# Altium project new_motherboard.PrjPCB
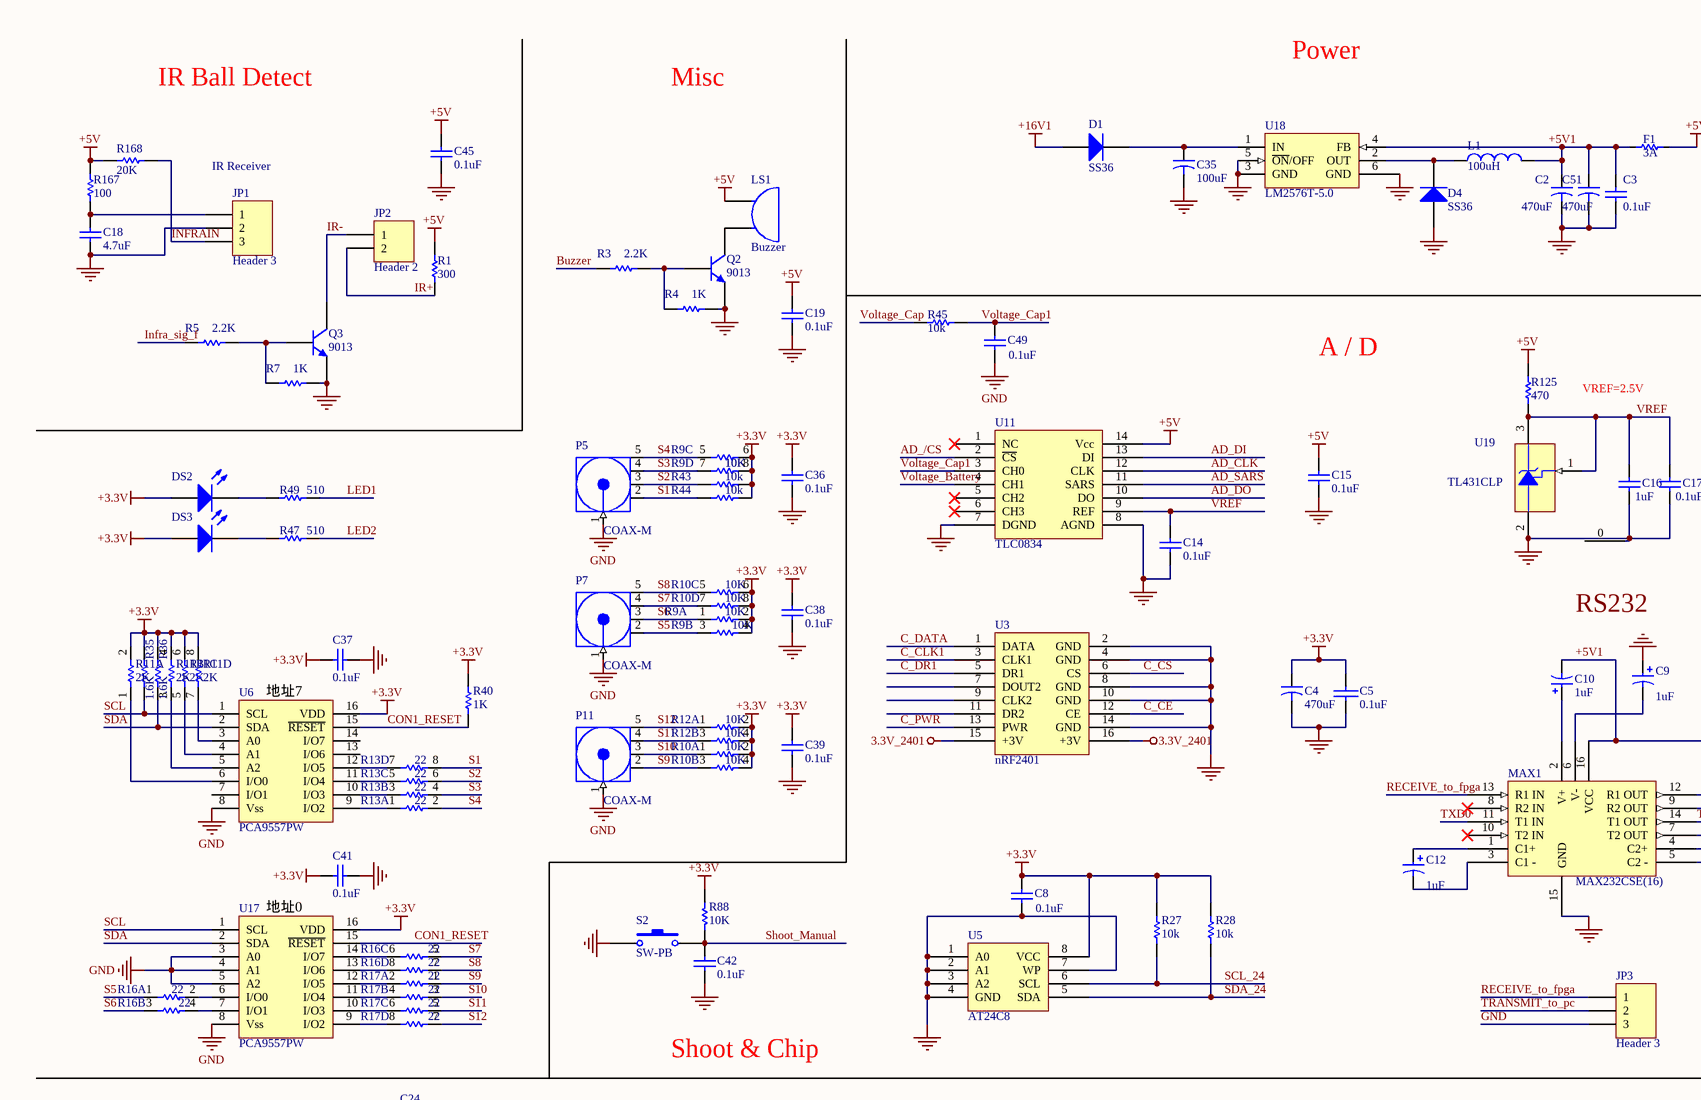
[diagram p0: SS_MB_CONV1.1.SchDoc, top left]
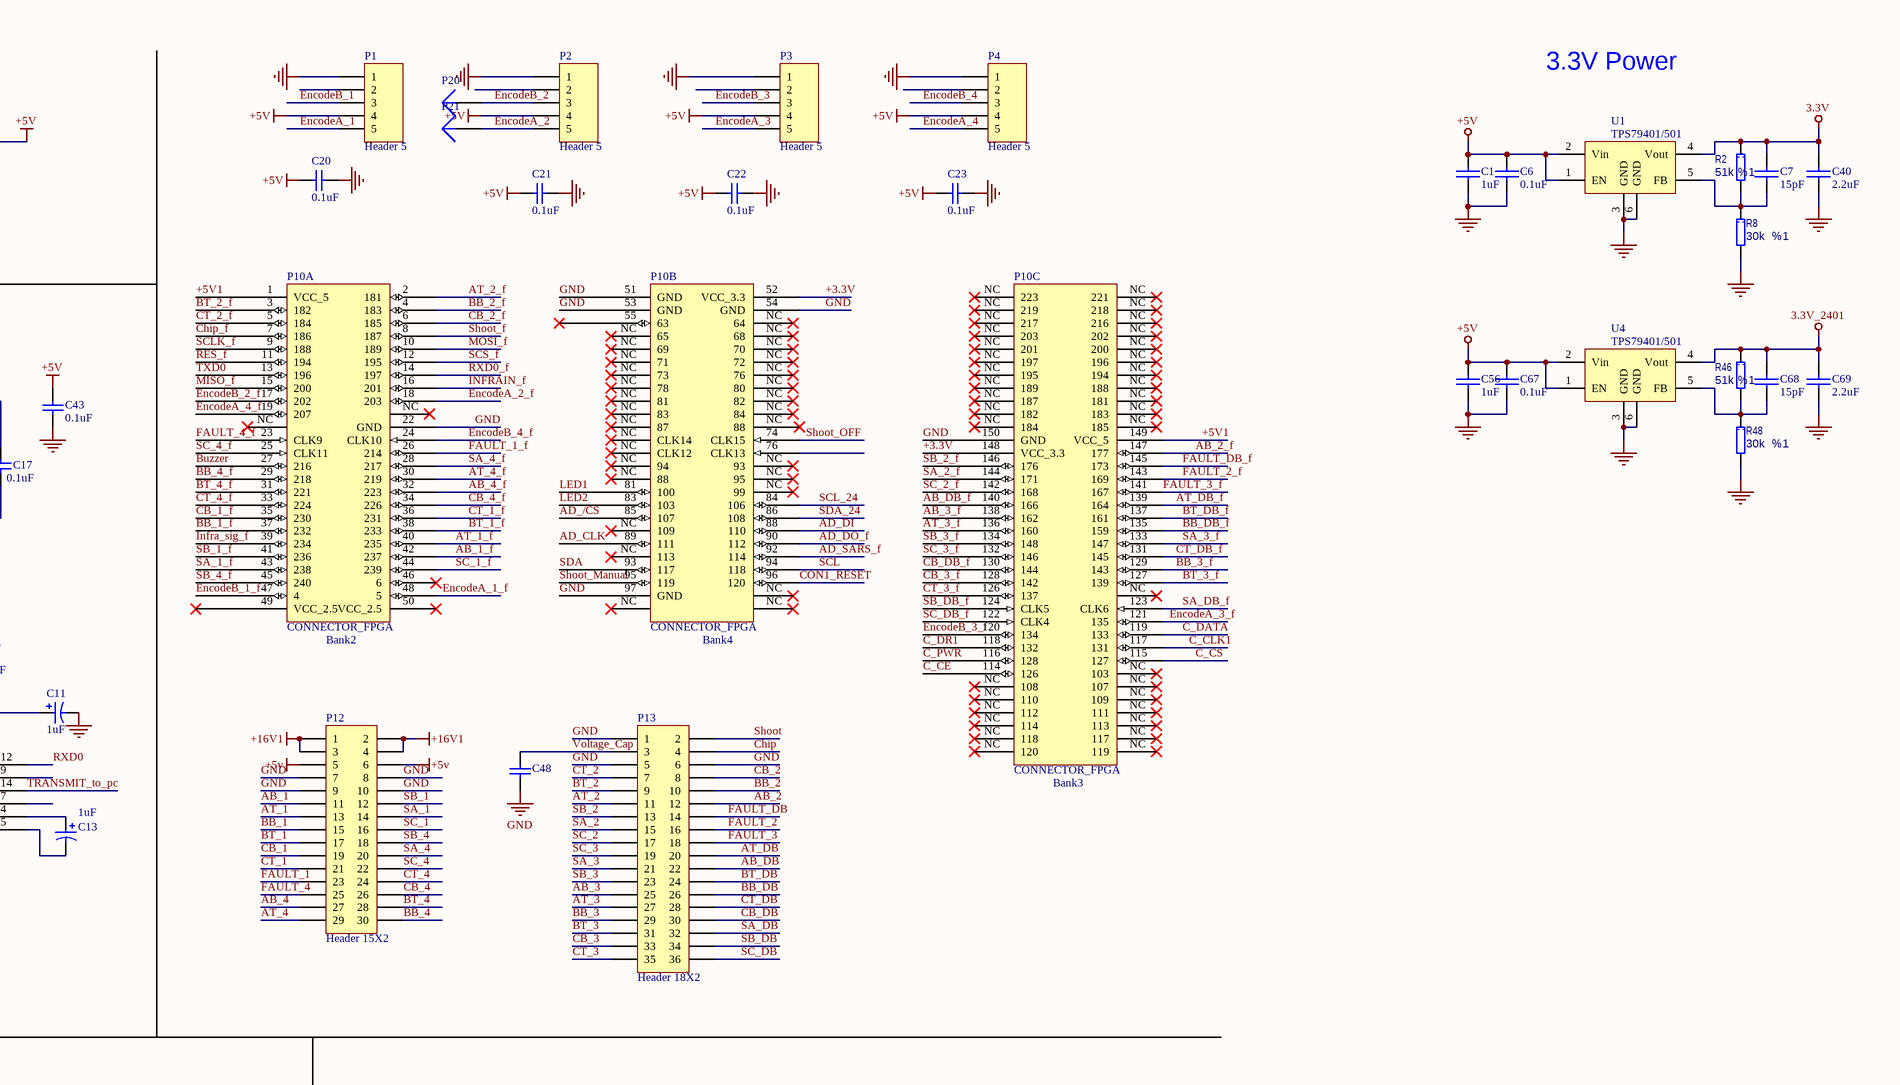
[diagram p1: SS_MB_CONV1.1.SchDoc, top right]
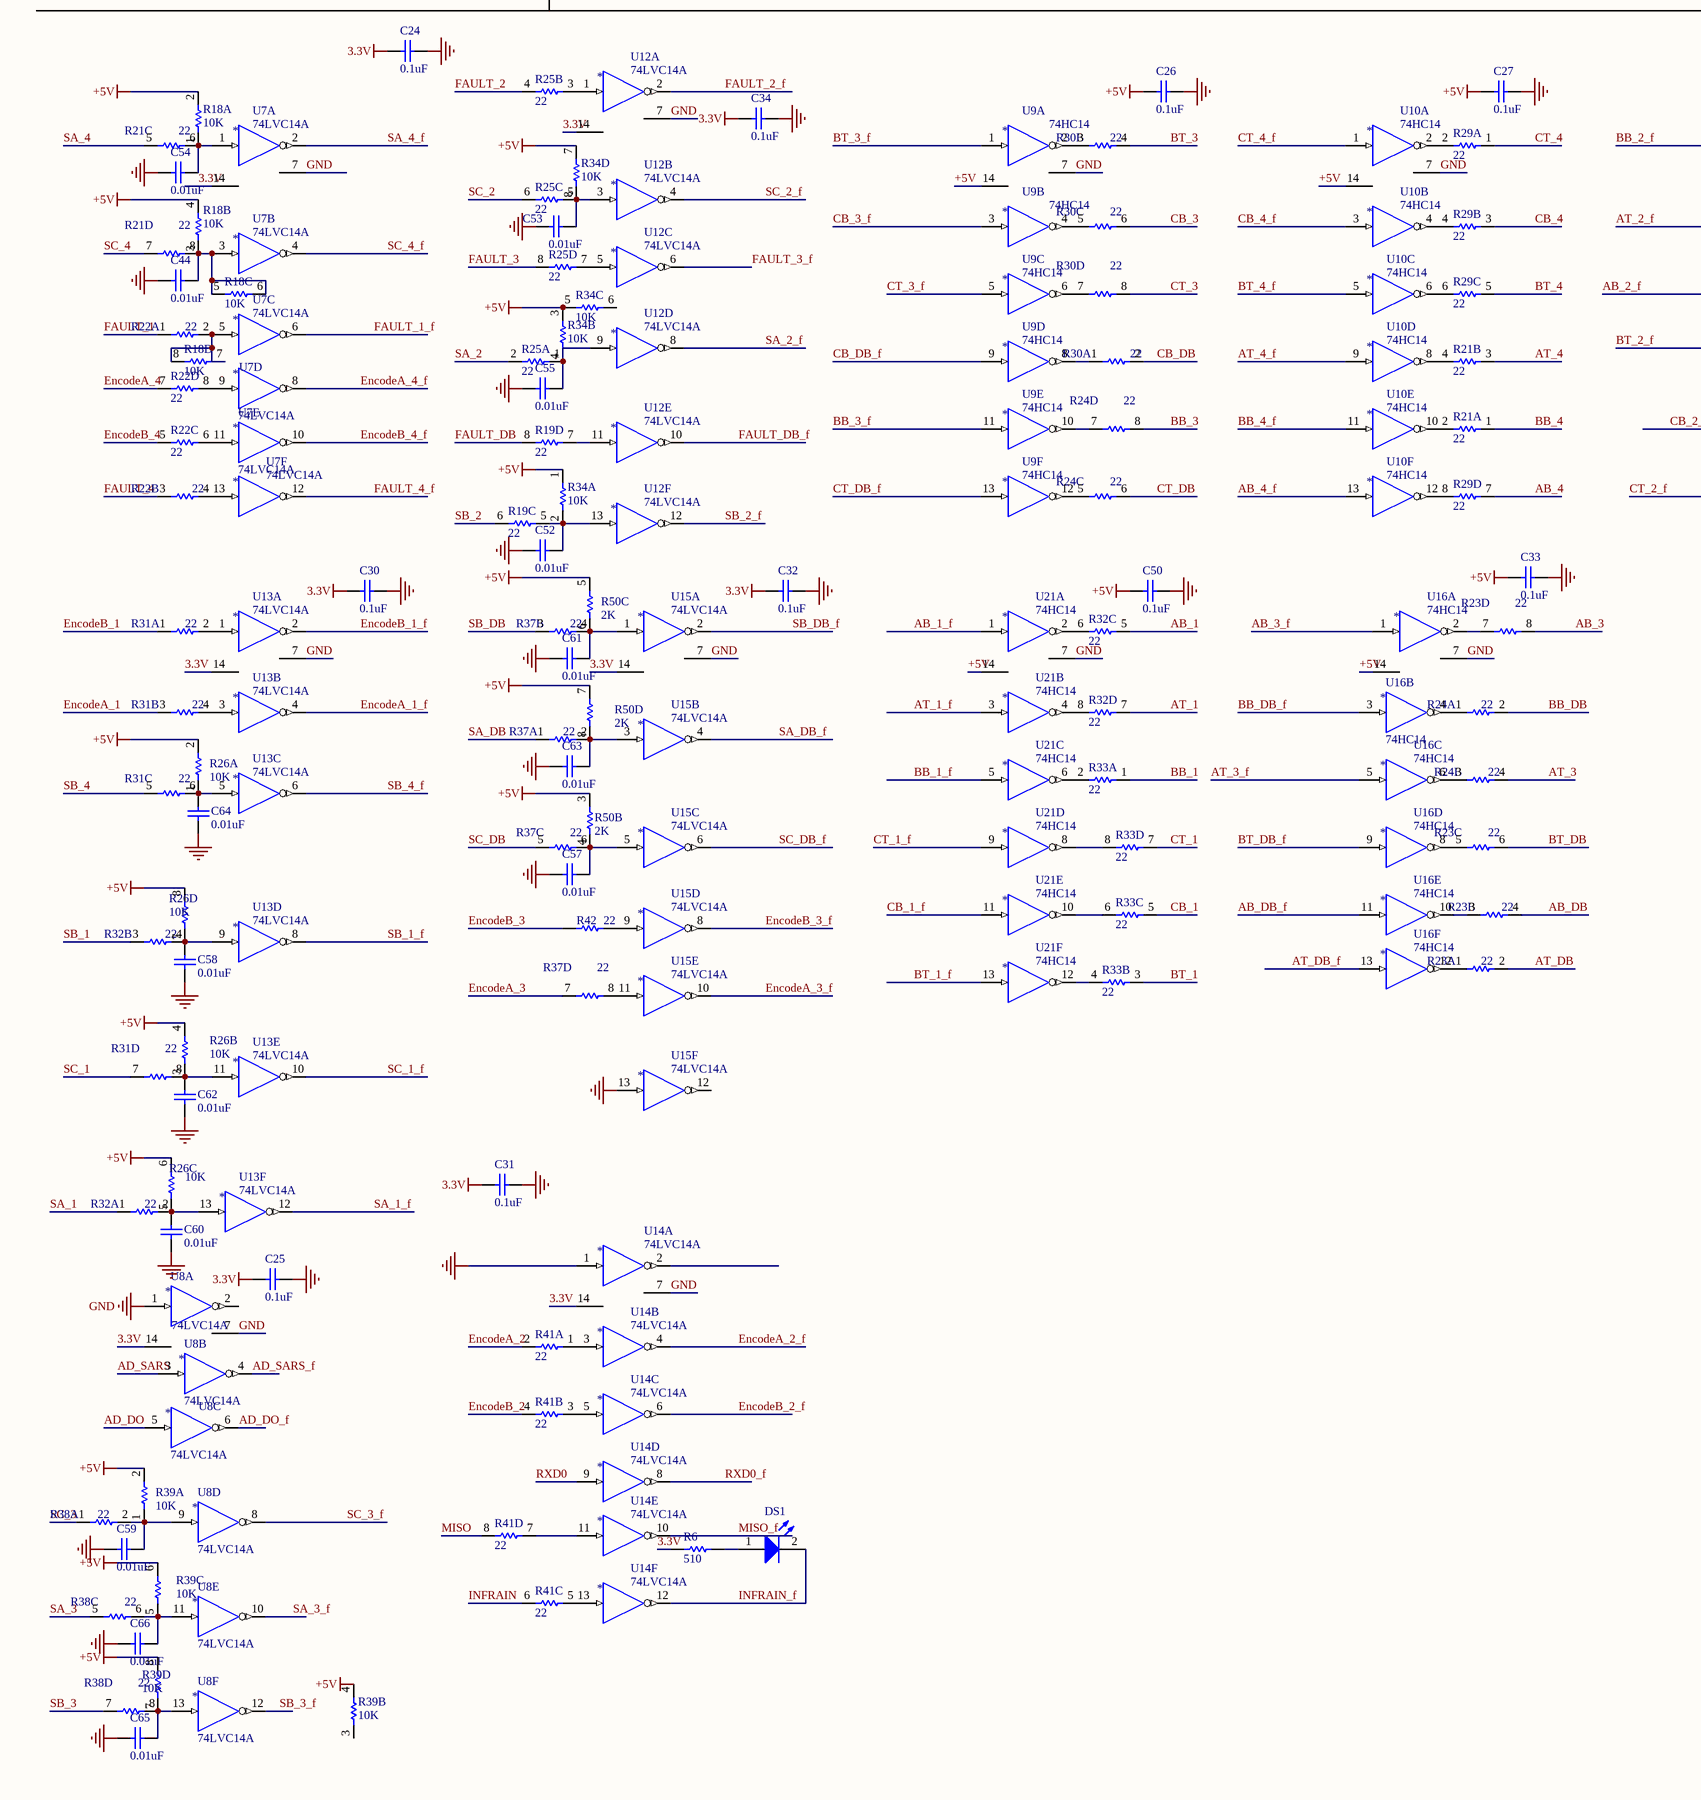
[diagram p2: SS_MB_CONV1.1.SchDoc, bottom left]
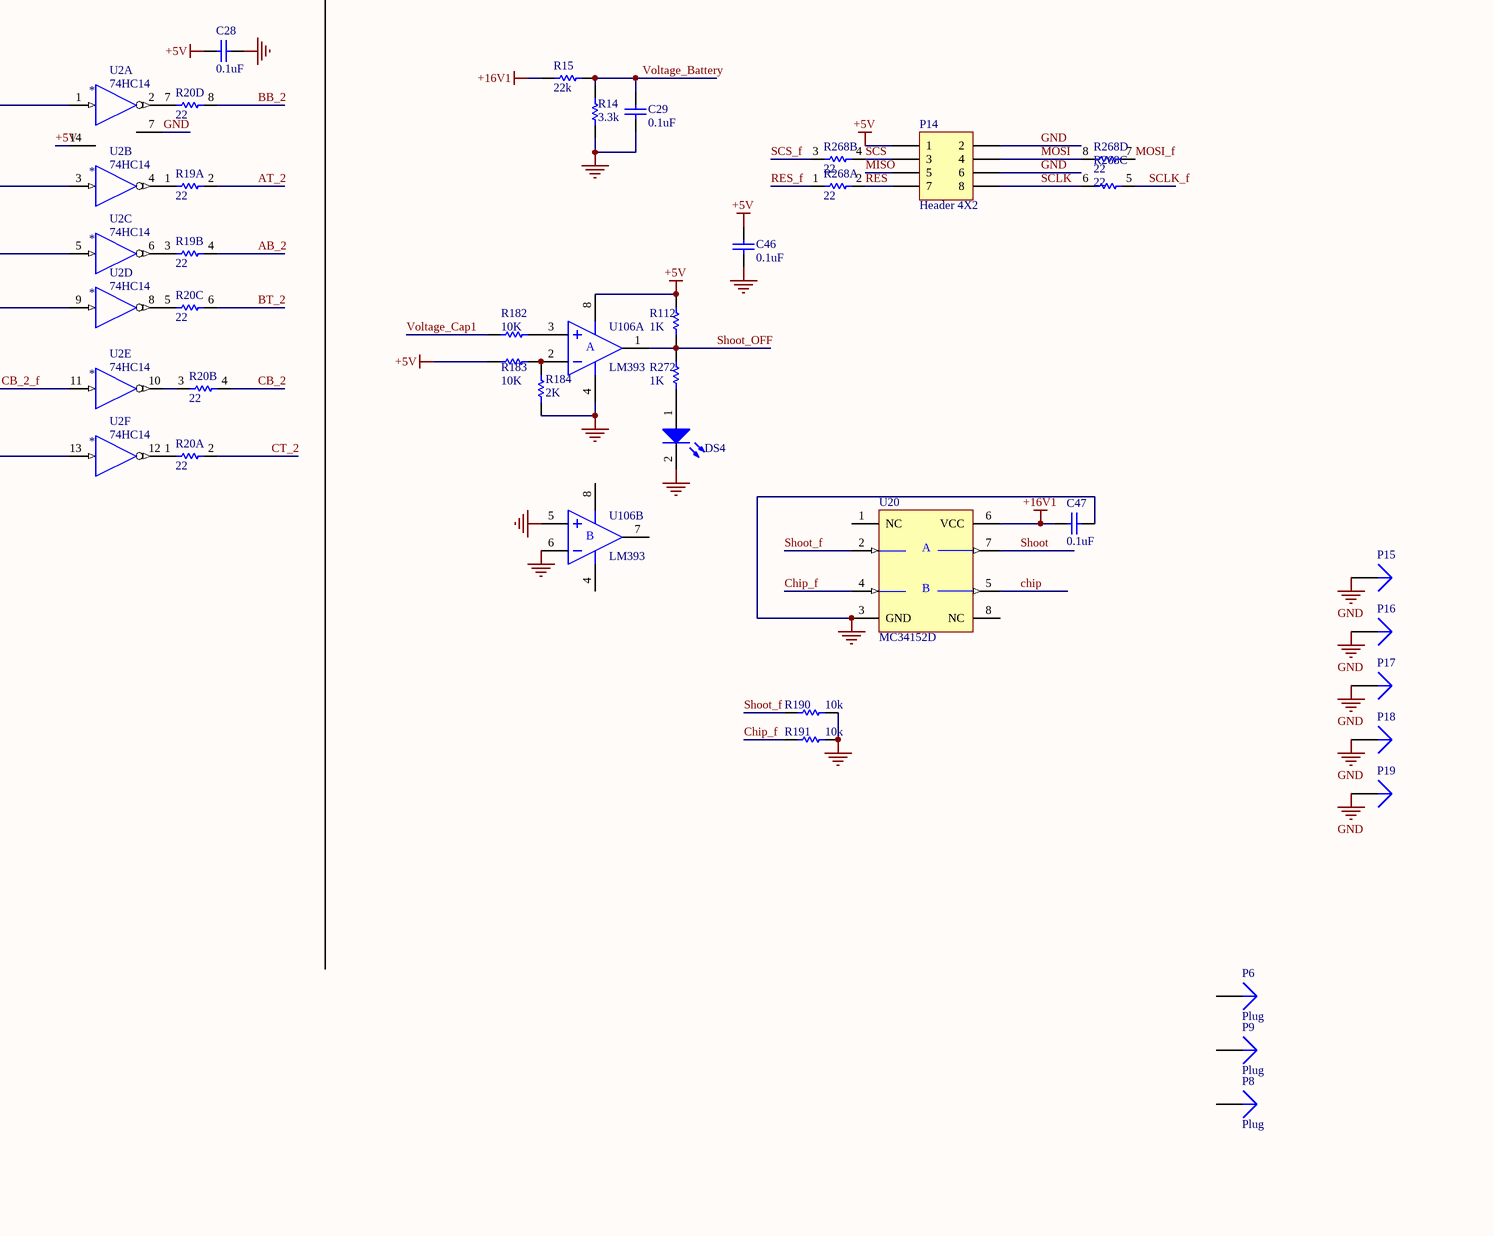
[diagram p3: SS_MB_CONV1.1.SchDoc, bottom right]
1 sheet, 190 parts. Net scope: global (net labels, ports and power ports of the same name join across sheets).
Board file: SS_MB_CONV1.1.PcbDoc

## Sheet SS_MB_CONV1.1.SchDoc
size A1

### Parts
C1  1uF  [0805C]
C2  470uF  [J10]
C3  0.1uF  [0805C]
C4  470uF  [J10]
C5  0.1uF  [0805C]
C6  0.1uF  [0805C]
C7  15pF  [0805C]
C8  0.1uF  [0805C]
C9  1uF  [0805C]
C10  1uF  [0805C]
C11  1uF  [0805C]
C12  1uF  [0805C]
C13  1uF  [0805C]
C14  0.1uF  [0805C]
C15  0.1uF  [0805C]
C16  1uF  [0805C]
C17  0.1uF  [0805C]
C18  4.7uF  [0805C]
C19  0.1uF  [0805C]
C20  0.1uF  [0805C]
C21  0.1uF  [0805C]
C22  0.1uF  [0805C]
C23  0.1uF  [0805C]
C24  0.1uF  [0805C]
C25  0.1uF  [0805C]
C26  0.1uF  [0805C]
C27  0.1uF  [0805C]
C28  0.1uF  [0805C]
C29  0.1uF  [0805C]
C30  0.1uF  [0805C]
C31  0.1uF  [0805C]
C32  0.1uF  [0805C]
C33  0.1uF  [0805C]
C34  0.1uF  [0805C]
C35  100uF  [CAPPR2.5-6.3]
C36  0.1uF  [0805C]
C37  0.1uF  [0805C]
C38  0.1uF  [0805C]
C39  0.1uF  [0805C]
C40  2.2uF  [0805C]
C41  0.1uF  [0805C]
C42  0.1uF  [0805C]
C43  0.1uF  [0805C]
C44  0.01uF  [0805C]
C45  0.1uF  [0805C]
C46  0.1uF  [0805C]
C47  0.1uF  [0805C]
C48  0.1uF  [0805C]  (value not drawn)
C49  0.1uF  [0805C]
C50  0.1uF  [0805C]
C51  470uF  [J10]
C52  0.01uF  [0805C]
C53  0.01uF  [0805C]
C54  0.01uF  [0805C]
C55  0.01uF  [0805C]
C56  1uF  [0805C]
C57  0.01uF  [0805C]
C58  0.01uF  [0805C]
C59  0.01uF  [0805C]
C60  0.01uF  [0805C]
C61  0.01uF  [0805C]
C62  0.01uF  [0805C]
C63  0.01uF  [0805C]
C64  0.01uF  [0805C]
C65  0.01uF  [0805C]
C66  0.01uF  [0805C]
C67  0.1uF  [0805C]
C68  15pF  [0805C]
C69  2.2uF  [0805C]
D1  SS36  [SMC]
D4  SS36  [SMC]
DS1  LED2  [0805D]  (value not drawn)
DS2  LED1  [0805D]  (value not drawn)
DS3  LED2  [0805D]  (value not drawn)
DS4  LED2  [0805D]  (value not drawn)
F1  3A  [2512r]
JP1  Header 3  [SMD-3P-1.25]
JP2  Header 2  [SMD-2P-1.25]
JP3  Header 3  [5264-R-3P-2.54]
L1  value 100uH  [L]  (hidden comment: Inductor)
LS1  Buzzer  [Buzzer]
MAX1  MAX232CSE(16)  [NSO16]
P1  Header 5  [SMD-5P-1.25]
P2  Header 5  [SMD-5P-1.25]
P3  Header 5  [SMD-5P-1.25]
P4  Header 5  [SMD-5P-1.25]
P5  COAX-M  [A6RV-161RS]
P6  Plug  [MARK]
P7  COAX-M  [A6RV-161RS]
P8  Plug  [MARK]
P9  Plug  [MARK]
P10  CONNECTOR_FPGA  [CONNECTOR_FPGA]  (parts A,B,C of 3)
P11  COAX-M  [A6RV-161RS]
P12  Header 15X2  [HDR2X15]
P13  Header 18X2  [HDR2X18]
P14  Header 4X2  [HDR2X4]
P15  安装孔  [安装孔 3.5-5]  (value not drawn)
P16  安装孔  [安装孔 3.5-5]  (value not drawn)
P17  安装孔  [安装孔 3.5-5]  (value not drawn)
P18  安装孔  [安装孔 3.5-5]  (value not drawn)
P19  安装孔  [安装孔 3.5-5]  (value not drawn)
P20  安装孔  [TestPoint]  (value not drawn)
P21  安装孔  [TestPoint]  (value not drawn)
Q2  9013  [SO-G3/Y1]
Q3  9013  [SO-G3/Y1]
R1  300  [0805R]
R2  51k ％1  [0805R]
R3  2.2K  [0805R]
R4  1K  [0805R]
R5  2.2K  [0805R]
R6  510  [0805R]
R7  1K  [0805R]
R8  30k  ％1  [0805R]
R9  10K  [0603排阻]  (parts A,B,C,D of 4)
R10  10K  [0603排阻]  (parts A,B,C,D of 4)
R11  2K  [0603排阻]  (parts A,B,C,D of 4)
R12  10K  [0603排阻]  (parts A,B of 4)
R13  22  [0603排阻]  (parts A,B,C,D of 4)
R14  3.3k  [0805R]
R15  22k  [0805R]
R16  22  [0603排阻]  (parts A,B,C,D of 4)
R17  22  [0603排阻]  (parts A,B,C,D of 4)
R18  10K  [0603排阻]  (parts A,B,C,D of 4)
R19  22  [0603排阻]  (parts A,B,C,D of 4)
R20  22  [0603排阻]  (parts A,B,C,D of 4)
R21  22  [0603排阻]  (parts A,B,C,D of 4)
R22  22  [0603排阻]  (parts A,B,C,D of 4)
R23  22  [0603排阻]  (parts A,B,C,D of 4)
R24  22  [0603排阻]  (parts A,B,C,D of 4)
R25  22  [0603排阻]  (parts A,B,C,D of 4)
R26  10K  [0603排阻]  (parts A,B,C,D of 4)
R27  10k  [0805R]
R28  10k  [0805R]
R29  22  [0603排阻]  (parts A,B,C,D of 4)
R30  22  [0603排阻]  (parts A,B,C,D of 4)
R31  22  [0603排阻]  (parts A,B,C,D of 4)
R32  22  [0603排阻]  (parts A,B,C,D of 4)
R33  22  [0603排阻]  (parts A,B,C,D of 4)
R34  10K  [0603排阻]  (parts A,B,C,D of 4)
R35  1.6K  [0805R]
R36  1.6K  [0805R]
R37  22  [0603排阻]  (parts A,B,C,D of 4)
R38  22  [0603排阻]  (parts A,C,D of 4)
R39  10K  [0603排阻]  (parts A,B,C,D of 4)
R40  1K  [0805R]
R41  22  [0603排阻]  (parts A,B,C,D of 4)
R42  22  [0805R]
R43  10k  [0805R]
R44  10k  [0805R]
R45  10k  [0805R]
R46  51k ％1  [0805R]
R47  510  [0805R]
R48  30k  ％1  [0805R]
R49  510  [0805R]
R50  2K  [0603排阻]  (parts B,C,D of 4)
R88  10K  [0805R]
R112  1K  [0805R]
R125  470  [0805R]
R167  100  [0805R]
R168  20K  [0805R]
R182  10K  [0805R]
R183  10K  [0805R]
R184  2K  [0805R]
R190  10k  [0805R]
R191  10k  [0805R]
R268  22  [0603排阻]  (parts A,B,C,D of 4)
R272  1K  [0805R]
S2  SW-PB  [SWPUSH]
U1  TPS79401/501  [SOT223-6]
U2  *  [SOP14]  (parts A,B,C,D,E,F of 6)
U3  nRF2401  [HDR2X8]
U4  TPS79401/501  [SOT223-6]
U5  AT24C8  [SO-G8]
U6  PCA9557PW  [TSSOP16]
U7  *  [SOP14]  (parts A,B,C,D,E,F of 6)
U8  *  [SOP14]  (parts A,B,C,D,E,F of 6)
U9  *  [SOP14]  (parts A,B,C,D,E,F of 6)
U10  *  [SOP14]  (parts A,B,C,D,E,F of 6)
U11  TLC0834  [SO-14]
U12  *  [SOP14]  (parts A,B,C,D,E,F of 6)
U13  *  [SOP14]  (parts A,B,C,D,E,F of 6)
U14  *  [SOP14]  (parts A,B,C,D,E,F of 6)
U15  *  [SOP14]  (parts A,B,C,D,E,F of 6)
U16  *  [SOP14]  (parts A,B,C,D,E,F of 6)
U17  PCA9557PW  [TSSOP16]
U18  LM2576T-5.0  [D2PAK]
U19  TL431CLP  [SOT89]
U20  MC34152D  [SO-G8]
U21  *  [SOP14]  (parts A,B,C,D,E,F of 6)
U106  LM393  [SO-g8]  (parts A,B of 2)

### Nets
3.3V: C7.1 C24.2 C25.2 C30.2 C31.2 C32.2 C34.2 C40.1 R2.1 R6.1 U1.4(Vout) U7.14(VCC) U8.14(VCC) U12.14(VCC) U13.14(VCC) U14.14(VCC) U15.14(VCC)
3.3V_2401: C68.1 C69.1 R46.1 U3.15(+3V) U3.16(+3V) U4.4(Vout)
+3.3V: C4.1 C5.1 C8.2 C36.2 C37.2 C38.2 C39.2 C41.2 DS2.1(A) DS3.1(A) P10.52(VCC_3.3) P10.148(VCC_3.3) R9.2 R9.4 R9.6 R9.8 R10.2 R10.4 R10.6 R10.8 R11.2 R11.4 R11.6 R11.8 R12.2 R12.4 R27.2 R28.2 R35.1 R36.1 R40.2 R43.2 R44.2 R88.2 U5.8(VCC) U6.16(VDD) U17.16(VDD)
+5V: C1.1 C6.1 C15.2 C19.2 C20.2 C21.2 C22.2 C23.2 C26.2 C27.2 C28.2 C33.2 C43.2 C45.2 C46.2 C50.2 C56.1 C67.1 F1.2 LS1.1(A) P1.4 P2.4 P3.4 P4.4 P12.5 P12.6 P14.1 R1.2 R18.2 R18.4 R26.2 R26.4 R26.6 R26.8 R34.1 R34.3 R34.5 R34.7 R39.2 R39.4 R39.6 R39.8 R50.3 R50.5 R50.7 R112.2 R125.2 R167.2 R168.2 R183.2 U1.1(EN) U1.2(Vin) U2.14(VCC) U4.1(EN) U4.2(Vin) U9.14(VCC) U10.14(VCC) U11.14(Vcc) U16.14(VCC) U21.14(VCC) U106.8(V+)
+5V1: C2.1 C3.2 C10.2 C11.1 C51.1 F1.1 L1.2 MAX1.16(VCC) P10.1(VCC_5) P10.149(VCC_5) U18.4(FB)  [also labelled VCC]
+16V1: C47.1 D1.1(A) P12.1 P12.2 P12.3 P12.4 R15.2 U20.6(VCC)
GND: C1.2 C2.2 C3.1 C4.2 C5.2 C6.2 C8.1 C9.1 C11.2 C14.1 C15.1 C16.1 C17.1 C18.2 C19.1 C20.1 C21.1 C22.1 C23.1 C24.1 C25.1 C26.1 C27.1 C28.1 C29.1 C30.1 C31.1 C32.1 C33.1 C34.1 C35.2 C36.1 C37.1 C38.1 C39.1 C40.2 C41.1 C42.1 C43.1 C44.2 C45.1 C46.1 C47.2 C48.1 C49.1 C50.1 C51.2 C52.2 C53.2 C54.2 C55.2 C56.2 C57.2 C58.2 C59.2 C60.2 C61.2 C62.2 C63.2 C64.2 C65.2 C66.2 C67.2 C69.2 D4.1(A) DS4.2(K) JP1.2 JP3.3 MAX1.15(GND) P1.1 P2.1 P3.1 P4.1 P5.1(Signal) P7.1(Signal) P10.22(GND) P10.51(GND) P10.53(GND) P10.54(GND) P10.97(GND) P10.150(GND) P11.1(Signal) P12.7 P12.8 P12.9 P12.10 P13.1 P13.5 P13.6 P14.2 P14.6 P15.1 P16.1 P17.1 P18.1 P19.1 Q2.2(E) Q3.2(E) R4.2 R7.2 R8.2 R14.1 R48.2 R184.2 R190.1 R191.1 S2.1 U1.3(GND) U1.6(GND) U2.7(GND) U3.2(GND) U3.4(GND) U3.8(GND) U3.10(GND) U3.14(GND) U4.3(GND) U4.6(GND) U5.1(A0) U5.2(A1) U5.3(A2) U5.4(GND) U5.7(WP) U6.8(Vss) U7.7(GND) U8.1(A) U8.7(GND) U9.7(GND) U10.7(GND) U11.7(DGND) U11.8(AGND) U12.7(GND) U13.7(GND) U14.1(A) U14.7(GND) U15.7(GND) U15.13(A) U16.7(GND) U17.3(A0) U17.4(A1) U17.5(A2) U17.8(Vss) U18.3(GND) U18.5(~{ON}/OFF) U18.6(GND) U19.0(GND) U19.2(A) U20.3(GND) U21.7(GND) U106.4(V-) U106.5(IN+) U106.6(IN-)
V+: C10.1 MAX1.2(V+)
V-: C9.2 MAX1.6(V-)
AB_1: P12.11 R32.5
AB_1_f: P10.42(237) U21.1(A)
AB_2: P13.12 R19.4
AB_2_f: P10.147(177) U2.5(A)
AB_3: P13.25 R23.8
AB_3_f: P10.138(162) U16.1(A)
AB_4: P12.27 R29.7
AB_4_f: P10.32(223) U10.13(A)
AB_DB: P13.22 R23.4
AB_DB_f: P10.140(166) U16.11(A)
AD_/CS: P10.85(107) U11.2(~{CS})
AD_CLK: P10.89(111) U11.12(CLK)
AD_DI: P10.88(110) U11.13(DI)
AD_DO: U8.5(A) U11.10(DO)
AD_DO_f: P10.90(112) U8.6(Y)
AD_SARS: U8.3(A) U11.11(SARS)
AD_SARS_f: P10.92(114) U8.4(Y)
AT_1: P12.13 R32.7
AT_1_f: P10.40(235) U21.3(A)
AT_2: P13.11 R19.2
AT_2_f: P10.2(181) U2.3(A)
AT_3: P13.27 R24.4
AT_3_f: P10.136(160) U16.5(A)
AT_4: P12.29 R21.3
AT_4_f: P10.30(219) U10.9(A)
AT_DB: P13.20 R23.2
AT_DB_f: P10.139(164) U16.13(A)
BB_1: P12.15 R33.1
BB_1_f: P10.37(232) U21.5(A)
BB_2: P13.10 R20.8
BB_2_f: P10.4(183) U2.1(A)
BB_3: P13.29 R24.8
BB_3_f: P10.129(143) U9.11(A)
BB_4: P12.30 R21.1
BB_4_f: P10.29(218) U10.11(A)
BB_DB: P13.26 R24.2
BB_DB_f: P10.135(159) U16.3(A)
BT_1: P12.17 R33.3
BT_1_f: P10.38(233) U21.13(A)
BT_2: P13.9 R20.6
BT_2_f: P10.3(182) U2.9(A)
BT_3: P13.31 R30.4
BT_3_f: P10.127(139) U9.1(A)
BT_4: P12.28 R29.5
BT_4_f: P10.31(221) U10.5(A)
BT_DB: P13.24 R23.6
BT_DB_f: P10.137(161) U16.9(A)
Buzzer: P10.27(216) R3.1
C_CE: P10.114(126) U3.12(CE)
C_CLK1: P10.117(131) U3.3(CLK1)
C_CS: P10.115(127) U3.6(CS)
C_DATA: P10.119(133) U3.1(DATA)
C_DR1: P10.118(132) U3.5(DR1)
C_PWR: P10.116(128) U3.13(PWR)
CB_1: P12.19 R33.5
CB_1_f: P10.35(230) U21.11(A)
CB_2: P13.8 R20.4
CB_2_f: P10.6(185) U2.11(A)
CB_3: P13.33 R30.6
CB_3_f: P10.128(142) U9.3(A)
CB_4: P12.26 R29.3
CB_4_f: P10.34(226) U10.3(A)
CB_DB: P13.30 R30.2
CB_DB_f: P10.130(144) U9.9(A)
Chip: P13.4 U20.5(~{OUTB})
Chip_f: P10.7(186) R191.2 U20.4(INB)
CON1_RESET: P10.96(120) R40.1 U6.15(~{RESET}) U17.15(~{RESET})
CT_1: P12.21 R33.7
CT_1_f: P10.36(231) U21.9(A)
CT_2: P13.7 R20.2
CT_2_f: P10.5(184) U2.13(A)
CT_3: P13.35 R30.8
CT_3_f: P10.126(137) U9.5(A)
CT_4: P12.24 R29.1
CT_4_f: P10.33(224) U10.1(A)
CT_DB: P13.28 R24.6
CT_DB_f: P10.131(145) U9.13(A)
EncodeA_1: P1.5 R31.3
EncodeA_1_f: P10.48(5) U13.4(Y)
EncodeA_2: P2.5 P21.1 R41.2
EncodeA_2_f: P10.18(203) U14.4(Y)
EncodeA_3: P3.5 R37.7
EncodeA_3_f: P10.121(135) U15.10(Y)
EncodeA_4: P4.5 R22.7
EncodeA_4_f: P10.19(207) U7.8(Y)
EncodeB_1: P1.3 R31.1
EncodeB_1_f: P10.47(4) U13.2(Y)
EncodeB_2: P2.3 P20.1 R41.4
EncodeB_2_f: P10.17(202) U14.6(Y)
EncodeB_3: P3.3 R42.2
EncodeB_3_f: P10.120(134) U15.8(Y)
EncodeB_4: P4.3 R22.5
EncodeB_4_f: P10.24(CLK10) U7.10(Y)
FAULT_1: P12.23 R22.1
FAULT_1_f: P10.26(214) U7.6(Y)
FAULT_2: P13.16 R25.4
FAULT_2_f: P10.143(169) U12.2(Y)
FAULT_3: P13.18 R25.8
FAULT_3_f: P10.141(167) U12.6(Y)
FAULT_4: P12.25 R22.3
FAULT_4_f: P10.23(CLK9) U7.12(Y)
FAULT_DB: P13.14 R19.8
FAULT_DB_f: P10.145(173) U12.10(Y)
Infra_sig_f: P10.39(234) R5.1
INFRAIN: JP1.3 R41.6 R168.1
INFRAIN_f: DS1.2(K) P10.16(201) U14.12(Y)
IR+: JP2.1(2) R1.1
IR-: JP2.2(1) Q3.3(C)
LED1: P10.81(100) R49.1
LED2: P10.83(103) R47.1
MISO: P14.5 R41.8
MISO_f: P10.15(200) U14.10(Y)
MOSI: P14.4 R268.8
MOSI_f: P10.10(189) R268.7
RECEIVE_to_fpga: JP3.1 MAX1.13(R1_IN)
RES: P14.7 R268.2
RES_f: P10.11(194) R268.1
RXD0: MAX1.12(R1_OUT) U14.9(A)
RXD0_f: P10.14(197) U14.8(Y)
S1: P5.2(GND) R13.8 R44.1
S2: P5.3(GND) R13.6 R43.1
S3: P5.4(GND) R9.7 R13.4
S4: P5.5(GND) R9.5 R13.2
S5: P7.2(GND) R9.3 R16.1
S6: P7.3(GND) R9.1 R16.3
S7: P7.4(GND) R10.7 R16.5
S8: P7.5(GND) R10.5 R16.7
S9: P11.2(GND) R10.3 R17.1
S10: P11.3(GND) R10.1 R17.3
S11: P11.4(GND) R12.3 R17.5
S12: P11.5(GND) R12.1 R17.7
SA_1: P12.14 R32.1
SA_1_f: P10.43(238) U13.12(Y)
SA_2: P13.15 R25.2
SA_2_f: P10.144(171) U12.8(Y)
SA_3: P13.21 R38.5
SA_3_f: P10.133(147) U8.10(Y)
SA_4: P12.20 R21.5
SA_4_f: P10.28(217) U7.2(Y)
SA_DB: P13.32 R37.1
SA_DB_f: P10.123(CLK6) U15.4(Y)
SB_1: P12.12 R32.3
SB_1_f: P10.41(236) U13.8(Y)
SB_2: P13.13 R19.6
SB_2_f: P10.146(176) U12.12(Y)
SB_3: P13.23 R38.7
SB_3_f: P10.134(148) U8.12(Y)
SB_4: P12.18 R31.5
SB_4_f: P10.45(240) U13.6(Y)
SB_DB: P13.34 R37.3
SB_DB_f: P10.124(CLK5) U15.2(Y)
SC_1: P12.16 R31.7
SC_1_f: P10.44(239) U13.10(Y)
SC_2: P13.17 R25.6
SC_2_f: P10.142(168) U12.4(Y)
SC_3: P13.19 R38.1
SC_3_f: P10.132(146) U8.8(Y)
SC_4: P12.22 R21.7
SC_4_f: P10.25(CLK11) U7.4(Y)
SC_DB: P13.36 R37.5
SC_DB_f: P10.122(CLK4) U15.6(Y)
SCL: P10.94(118) R35.2 U6.1(SCL) U17.1(SCL)
SCL_24: P10.84(106) R27.1 U5.6(SCL)
SCLK: P14.8 R268.6
SCLK_f: P10.9(188) R268.5
SCS: P14.3 R268.4
SCS_f: P10.12(195) R268.3
SDA: P10.93(117) R36.2 U6.2(SDA) U17.2(SDA)
SDA_24: P10.86(108) R28.1 U5.5(SDA)
Shoot: P13.2 U20.7(~{OUTA})
Shoot_f: P10.8(187) R190.2 U20.2(INA)
Shoot_Manual: C42.2 P10.95(119) R88.1 S2.2
Shoot_OFF: P10.74(CLK15) R112.1 R272.2 U106.1(OUT)
TRANSMIT_to_pc: JP3.2 MAX1.14(T1_OUT)
TXD0: MAX1.11(T1_IN) P10.13(196)
Voltage_Battery: C29.2 R14.2 R15.1 U11.4(CH1)
Voltage_Cap: C48.2 P13.3 R45.1
Voltage_Cap1: C49.2 R45.2 R182.2 U11.3(CH0)
VREF: C14.2 C16.2 C17.2 R125.1 U11.9(REF) U19.1(REF) U19.3(K)
NetC7_2: C7.2 R2.2 R8.1 U1.5(FB)
NetC12_1: C12.1 MAX1.1(C1+)
NetC12_2: C12.2 MAX1.3(C1_-)
NetC13_1: C13.1 MAX1.4(C2+)
NetC13_2: C13.2 MAX1.5(C2_-)
NetC18_1: C18.1 JP1.1 R167.1
NetC35_1: C35.1 D1.2(K) U18.1(IN)
NetC44_1: C44.1 R18.3 R18.5 R18.6 R21.8 U7.3(A)
NetC52_1: C52.1 R19.5 R34.2 U12.13(A)
NetC53_1: C53.1 R25.5 R34.8 U12.3(A)
NetC54_1: C54.1 R18.1 R21.6 U7.1(A)
NetC55_1: C55.1 R25.1 R34.4 U12.9(A)
NetC57_1: C57.1 R37.6 R50.4 U15.5(A)
NetC58_1: C58.1 R26.7 R32.4 U13.9(A)
NetC59_1: C59.1 R38.2 R39.1 U8.9(A)
NetC60_1: C60.1 R26.5 R32.2 U13.13(A)
NetC61_1: C61.1 R37.4 R50.6 U15.1(A)
NetC62_1: C62.1 R26.3 R31.8 U13.11(A)
NetC63_1: C63.1 R37.2 R50.8 U15.3(A)
NetC64_1: C64.1 R26.1 R31.6 U13.5(A)
NetC65_1: C65.1 R38.8 R39.7 U8.13(A)
NetC66_1: C66.1 R38.6 R39.5 U8.11(A)
NetC68_2: C68.2 R46.2 R48.1 U4.5(FB)
NetD4_2: D4.2(K) L1.1 U18.2(OUT)
NetDS1_1: DS1.1(A) R6.2
NetDS2_2: DS2.2(K) R49.2
NetDS3_2: DS3.2(K) R47.2
NetDS4_1: DS4.1(A) R272.1
NetLS1_2: LS1.2(B) Q2.3(C)
NetQ2_1: Q2.1(B) R3.2 R4.1
NetQ3_1: Q3.1(B) R5.2 R7.1
NetR11_1: R11.1 U6.6(I/O0)
NetR11_3: R11.3 U6.5(A2)
NetR11_5: R11.5 U6.4(A1)
NetR11_7: R11.7 U6.3(A0)
NetR13_1: R13.1 U6.9(I/O2)
NetR13_3: R13.3 U6.10(I/O3)
NetR13_5: R13.5 U6.11(I/O4)
NetR13_7: R13.7 U6.12(I/O5)
NetR16_2: R16.2 U17.6(I/O0)
NetR16_4: R16.4 U17.7(I/O1)
NetR16_6: R16.6 U17.14(I/O7)
NetR16_8: R16.8 U17.13(I/O6)
NetR17_2: R17.2 U17.12(I/O5)
NetR17_4: R17.4 U17.11(I/O4)
NetR17_6: R17.6 U17.10(I/O3)
NetR17_8: R17.8 U17.9(I/O2)
NetR18_7: R18.7 R18.8 R22.2 U7.5(A)
NetR19_1: R19.1 U2.4(Y)
NetR19_3: R19.3 U2.6(Y)
NetR19_7: R19.7 U12.11(A)
NetR20_1: R20.1 U2.12(Y)
NetR20_3: R20.3 U2.10(Y)
NetR20_5: R20.5 U2.8(Y)
NetR20_7: R20.7 U2.2(Y)
NetR21_2: R21.2 U10.10(Y)
NetR21_4: R21.4 U10.8(Y)
NetR22_4: R22.4 U7.13(A)
NetR22_6: R22.6 U7.11(A)
NetR22_8: R22.8 U7.9(A)
NetR23_1: R23.1 U16.12(Y)
NetR23_3: R23.3 U16.10(Y)
NetR23_5: R23.5 U16.8(Y)
NetR23_7: R23.7 U16.2(Y)
NetR24_1: R24.1 U16.4(Y)
NetR24_3: R24.3 U16.6(Y)
NetR24_5: R24.5 U9.12(Y)
NetR24_7: R24.7 U9.10(Y)
NetR25_3: R25.3 U12.1(A)
NetR25_7: R25.7 U12.5(A)
NetR29_2: R29.2 U10.2(Y)
NetR29_4: R29.4 U10.4(Y)
NetR29_6: R29.6 U10.6(Y)
NetR29_8: R29.8 U10.12(Y)
NetR30_1: R30.1 U9.8(Y)
NetR30_3: R30.3 U9.2(Y)
NetR30_5: R30.5 U9.4(Y)
NetR30_7: R30.7 U9.6(Y)
NetR31_2: R31.2 U13.1(A)
NetR31_4: R31.4 U13.3(A)
NetR32_6: R32.6 U21.2(Y)
NetR32_8: R32.8 U21.4(Y)
NetR33_2: R33.2 U21.6(Y)
NetR33_4: R33.4 U21.12(Y)
NetR33_6: R33.6 U21.10(Y)
NetR33_8: R33.8 U21.8(Y)
NetR37_8: R37.8 U15.11(A)
NetR41_1: R41.1 U14.3(A)
NetR41_3: R41.3 U14.5(A)
NetR41_5: R41.5 U14.13(A)
NetR41_7: R41.7 U14.11(A)
NetR42_1: R42.1 U15.9(A)
NetR182_1: R182.1 U106.3(IN+)
NetR183_1: R183.1 R184.1 U106.2(IN-)

Not connected (* = marked no-connect by the designer): MAX1 7(T2_OUT) 8(R2_IN)* 9(R2_OUT) 10(T2_IN)*; P1 2; P2 2; P3 2; P4 2; P6 1; P8 1; P9 1; P10 46(6)* 49(VCC_2.5)* 50(VCC_2.5)* 55(63)* 76(CLK13) NC(99)*; R34 6; R39 3; S2 3 4; U3 7(DOUT2) 9(CLK2) 11(DR2); U6 7(I/O1) 13(I/O6) 14(I/O7); U8 2(Y); U11 1(NC)* 5(CH2)* 6(CH3)*; U14 2(Y); U15 12(Y); U20 1(NC) 8(NC); U106 7(OUT)

### Notes on the sheet
- IR Ball Detect
- Misc
- Power
- 3.3V Power
- (near JP1) IR Receiver
- A / D
- VREF=2.5V
- RS232
- (near U6) 地址7
- (near P10) Bank2
- (near P10) Bank4
- (near P10) Bank3
- (near U17) 地址0
- Shoot & Chip
- (in symbol LM393, part A) A
- (in symbol LM393, part B) B
- (in symbol MC34152D) A; B

### Library data of the parts
C1 C5-C7 C40 C56 C67-C69 = CAP: Capacitor
C2 C51 = Cap2: 25V 470uf 10*10; Published: 23-Sep-2002; Publisher: Altium Limited
C3 C8 C18-C34 C36-C39 C41 C42 C44-C47 C50 C52-C55 C57-C66 = Cap: Capacitor; Published: 8-Jun-2000; LatestRevisionDate: 17-Jul-2002; LatestRevisionNote: Re-released for DXP Platform.; Publisher: Altium Limited
  C8 C19-C28 C30-C34 C36-C39 C41 C42 C45 C50: Value: 0.1uF
  C18: Value: 4.7uF
  C44 C52-C55 C57-C66: Value: 0.01uF
C4 C35 = Cap2: Capacitor; Published: 23-Sep-2002; Publisher: Altium Limited
C9-C13 = CAP2: Bi-Polar Capacitor; Value: 1uF
C14-C17 C43 C48 C49 = Cap: Capacitor; Manufacturer: Generic Components; Class: Passive; Published: 08/06/2000; Publisher: Altium Hobart Technology Centre; SubClass: Capacitor
  C14 C15 C17 C43 C48 C49: Value: 0.1uF
  C16: Value: 1uF
D1 D4 = Diode: Default Diode; Manufacturer: Generic Components; Class: Discrete; SubClass: Diode - Switching; Published: 08/06/2000; Publisher: Altium Hobart Technology Centre
DS1 DS4 = LED2: Typical RED, GREEN, YELLOW, AMBER GaAs LED; Manufacturer: Generic Components; Class: Optoelectronic; Published: 08/06/2000; Publisher: Altium Hobart Technology Centre; SubClass: LED
DS2 = LED1: Typical RED, GREEN, YELLOW, AMBER GaAs LED; Published: 8-Jun-2000; LatestRevisionDate: 17-Jul-2002; LatestRevisionNote: Re-released for DXP Platform.; Publisher: Altium Limited
DS3 = LED2: Typical RED, GREEN, YELLOW, AMBER GaAs LED; Published: 8-Jun-2000; LatestRevisionDate: 17-Jul-2002; LatestRevisionNote: Re-released for DXP Platform.; Publisher: Altium Limited
F1 = Res1: Resistor; Published: 8-Jun-2000; LatestRevisionDate: 17-Jul-2002; LatestRevisionNote: Re-released for DXP Platform.; Publisher: Altium Limited
JP1 JP3 = Header 3: Header, 3-Pin; LatestRevisionDate: 17-Jul-2002; LatestRevisionNote: Re-released for DXP Platform.; Publisher: Altium Limited
JP2 = Header 2: Header, 2-Pin; LatestRevisionDate: 17-Jul-2002; LatestRevisionNote: Re-released for DXP Platform.; Publisher: Altium Limited
L1 = Inductor: Manufacturer: Generic Components; Class: Passive; Published: 08/06/2000; Publisher: Altium Hobart Technology Centre; SubClass: Inductor
LS1 = Buzzer: Manufacturer: Generic Components; Published: 1999
MAX1 = MAX232CSE(16): +-15KV ESD-PROTECTED, +5V RS-232 TRANSCEIVERS
P1-P4 = Header 5: Header, 5-Pin; LatestRevisionDate: 17-Jul-2002; LatestRevisionNote: Re-released for DXP Platform.; Publisher: Altium Limited
P5 P7 P11 = COAX-M: RF Coaxial PCB Connector, MMCX; Thru-Hole, Vertical Mount Plug,  50 Ohm Impedance; PackageDocument: Rev. A, 16-Jun-1997; PCB_Layout: Complies with manufacturer's recommendation.; DrillSize: Corresponds to nominal value.; Published: 15-Jul-2004; LatestRevisionDate: 15-Jul-2004; LatestRevisionNote: Component Replaced.; DatasheetDocument: 30-May-2003; PackageReference: 908-21103; Publisher: Altium Limited; ComponentLink1Description: Manufacturer Link; ComponentLink1URL: http://www.amphenolrf.com/
P12 = Header 15X2: Header, 15-Pin, Dual row; LatestRevisionDate: 17-Jul-2002; LatestRevisionNote: Re-released for DXP Platform.; Publisher: Altium Limited
P13 = Header 18X2: Header, 18-Pin, Dual row; LatestRevisionDate: 17-Jul-2002; LatestRevisionNote: Re-released for DXP Platform.; Publisher: Altium Limited
P14 = Header 4X2: Header, 4-Pin, Dual row; LatestRevisionDate: 17-Jul-2002; LatestRevisionNote: Re-released for DXP Platform.; Publisher: Altium Limited
P15-P21 = Plug: LatestRevisionDate: 17-Jul-2002; LatestRevisionNote: Re-released for DXP Platform.; Publisher: Altium Limited
Q2 Q3 = BC817-40: NPN General Purpose Amplifier; Manufacturer: Fairchild Semiconductor; Revised: 11-July-2000: SIM Model Added.; Class: Discrete; SubClass: BJT - Low Power; Published: 8/06/2000; Publisher: Altium Hobart Technology Centre
R1 R3-R7 R14 R15 R35 R36 R40 R42 R47 R49 R88 R112 R125 R167 R168 R182-R184 R272 = Res1: Resistor; Manufacturer: Generic Components; Class: Passive; Published: 08/06/2000; Publisher: Altium Hobart Technology Centre; SubClass: Resistor
  R1: Value: 300
  R3 R5: Value: 2.2K
  R4 R7 R40 R112 R272: Value: 1K
  R6 R47 R49: Value: 510
  R14: Value: 3.3k
  R15: Value: 22k
  R35 R36: Value: 1.6K
  R42: Value: 22
  R88 R182 R183: Value: 10K
  R125: Value: 470
  R167: Value: 100
  R168: Value: 20K
  R184: Value: 2K
R2 R8 R46 R48 = RES
R9-R13 R16-R26 R29-R34 R37-R39 R41 R50 R268 = 0805排阻
R27 R28 R43-R45 R190 R191 = SR0805: Resistance; VALUE: 10k
S2 = SW-PB: Switch; Published: 24-Mar-1999; LatestRevisionDate: 17-Jul-2002; LatestRevisionNote: Re-released for DXP Platform.; Publisher: Altium Limited
U1 U4 = TPS79401
U2 U7-U10 U12-U16 U21 = SN74HC14D: Hex Schmitt-Trigger Inverter; Published: 8-Jun-2000; LatestRevisionDate: 13-Apr-2006; LatestRevisionNote: IPC-7351 Footprint Added.; DatasheetVersion: May-1997; PackageVersion: Jan-1998; PackageReference: D014; Publisher: Altium Limited; PackageDescription: 14-Pin Small Outline Integrated Circuit 1.27 mm Pitch; Code_IPC: SOIC127P600-14; ComponentLink1Description: Manufacturer Link; ComponentLink1URL: http://www.ti.com/; ComponentLink2Description: Datasheet; ComponentLink2URL: http://www-s.ti.com/sc/ds/sn74hc14.pdf
  U2 U9 U10 U16 U21: 74HC14: 74HC14
  U7 U8 U12-U15: 74LVC14A: 74LVC14A
U3 = nRF2401: 2.4G, wireless
U11 = TLC0834: 8bit 4 channel , A to D
U18 = LM2575T-5.0: Simple Switcher 1A Step Down Voltage Regulator; Manufacturer: National Semiconductor; Class: Power Management; SubClass: Switching Regulator; Note: Tab is connected to GND; Published: 15/04/2002; Publisher: Altium Hobart Technology Centre
U19 = TL431CLP: Programmable Precision Reference; Manufacturer: ON Semiconductor; Class: Power Management; SubClass: Voltage Reference; Published: 15/04/2002; Publisher: Altium Hobart Technology Centre
U20 = MC34152D: High Speed Dual MOSFET Driver; Manufacturer: Motorola; Class: Interface; Published: 15/04/2002; Publisher: Altium Hobart Technology Centre; SubClass: MOSFET Driver
P6 P8 P9 = Plug: LatestRevisionDate: 17-Jul-2002; LatestRevisionNote: Re-released for DXP Platform.; Publisher: Altium Limited